# Altium schematic sheet LPCB225 - DISCHARGE.SchDoc
size A3; Address1: Factory 10; Address2: 9-13 Dingley Avenue, Dandeong, VICTORIA 3175, AUSTRALIA; DocumentNumber: 4; Revision: 1; SheetNumber: 4; SheetTotal: 6; Lockie__PCB_SUB_ASSEMBLY: Discharge Section; Lockie__PCB_ASSEMBLY: Module; Lockie__LDL: LPCB225; Lockie__PCB_DESCRIPTION: BMS Module
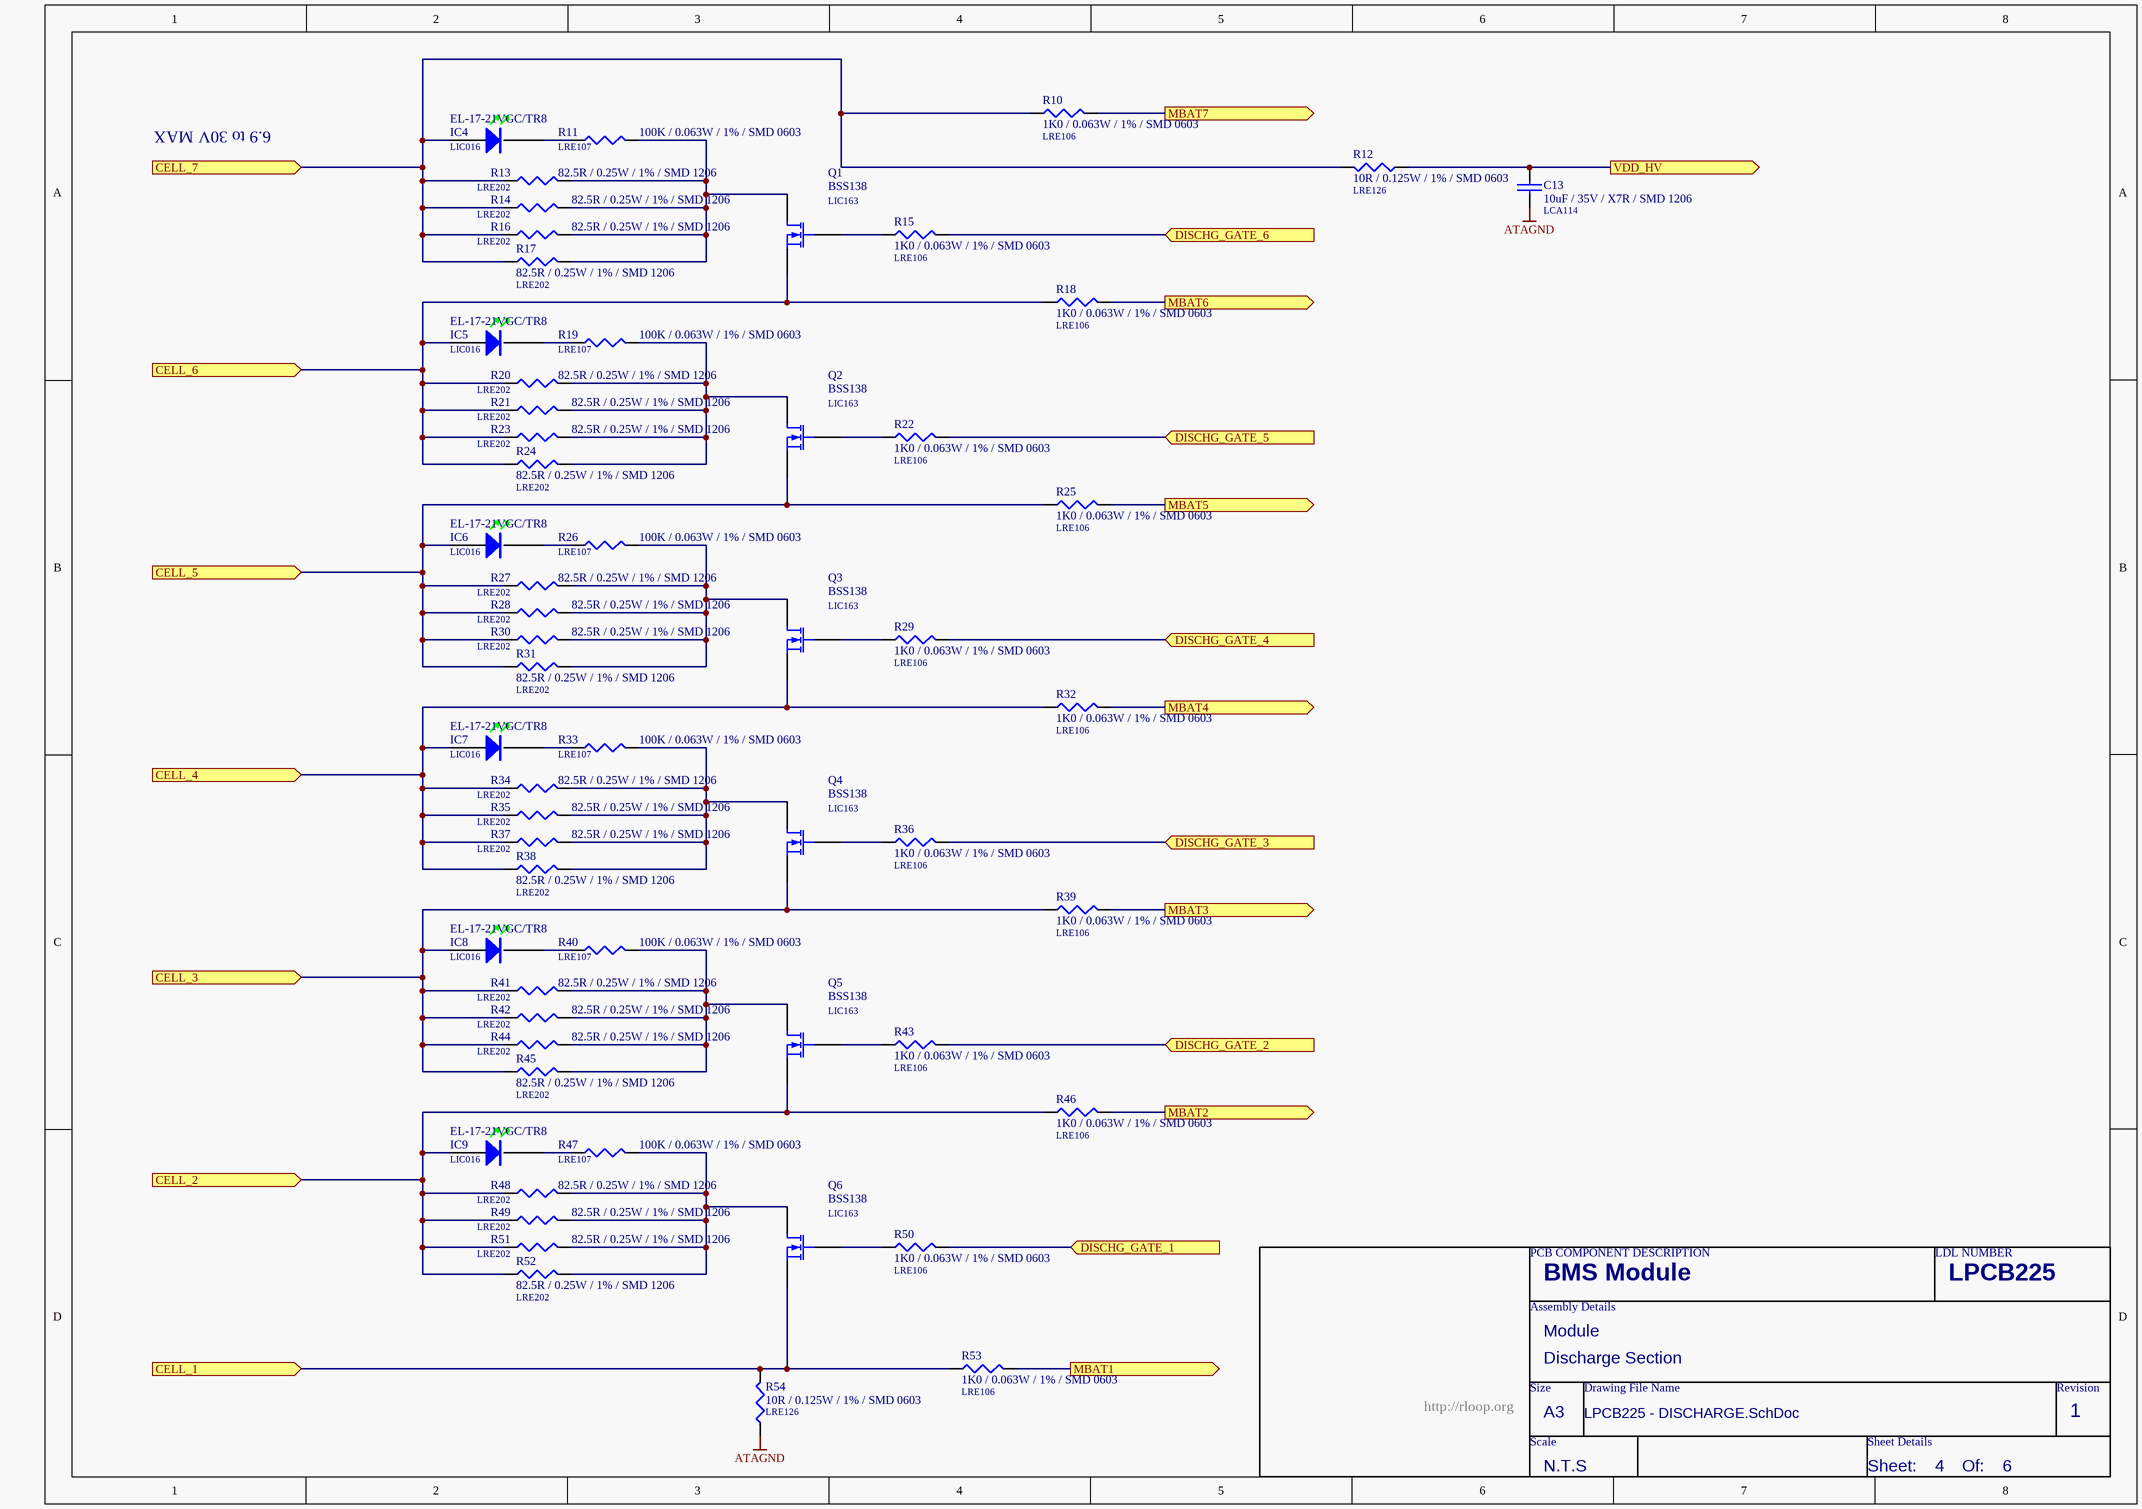
[diagram p0: LPCB225 - DISCHARGE.SchDoc]

## Parts
C13  10uF / 35V / X7R / SMD 1206  LDL_NUMBER: LCA114  [LFP043__CC3216-1206]
IC4  EL-17-21VGC/TR8  LDL_NUMBER: LIC016  [CR2012-0805-LED]
IC5  EL-17-21VGC/TR8  LDL_NUMBER: LIC016  [CR2012-0805-LED]
IC6  EL-17-21VGC/TR8  LDL_NUMBER: LIC016  [CR2012-0805-LED]
IC7  EL-17-21VGC/TR8  LDL_NUMBER: LIC016  [CR2012-0805-LED]
IC8  EL-17-21VGC/TR8  LDL_NUMBER: LIC016  [CR2012-0805-LED]
IC9  EL-17-21VGC/TR8  LDL_NUMBER: LIC016  [CR2012-0805-LED]
Q1  BSS138  LDL_NUMBER: LIC163  [LFP021__SOT23]
Q2  BSS138  LDL_NUMBER: LIC163  [LFP021__SOT23]
Q3  BSS138  LDL_NUMBER: LIC163  [LFP021__SOT23]
Q4  BSS138  LDL_NUMBER: LIC163  [LFP021__SOT23]
Q5  BSS138  LDL_NUMBER: LIC163  [LFP021__SOT23]
Q6  BSS138  LDL_NUMBER: LIC163  [LFP021__SOT23]
R10  1K0 / 0.063W / 1% / SMD 0603  LDL_NUMBER: LRE106  [LFP020__CR1608-0603-IPC7351_B]
R11  100K / 0.063W / 1% / SMD 0603  LDL_NUMBER: LRE107  [LFP020__CR1608-0603-IPC7351_B]
R12  10R / 0.125W / 1% / SMD 0603  LDL_NUMBER: LRE126  [LFP020__CR1608-0603-IPC7351_B]
R13  82.5R / 0.25W / 1% / SMD 1206  LDL_NUMBER: LRE202  [LFP107__CR3216-1206]
R14  82.5R / 0.25W / 1% / SMD 1206  LDL_NUMBER: LRE202  [LFP107__CR3216-1206]
R15  1K0 / 0.063W / 1% / SMD 0603  LDL_NUMBER: LRE106  [LFP020__CR1608-0603-IPC7351_B]
R16  82.5R / 0.25W / 1% / SMD 1206  LDL_NUMBER: LRE202  [LFP107__CR3216-1206]
R17  82.5R / 0.25W / 1% / SMD 1206  LDL_NUMBER: LRE202  [LFP107__CR3216-1206]
R18  1K0 / 0.063W / 1% / SMD 0603  LDL_NUMBER: LRE106  [LFP020__CR1608-0603-IPC7351_B]
R19  100K / 0.063W / 1% / SMD 0603  LDL_NUMBER: LRE107  [LFP020__CR1608-0603-IPC7351_B]
R20  82.5R / 0.25W / 1% / SMD 1206  LDL_NUMBER: LRE202  [LFP107__CR3216-1206]
R21  82.5R / 0.25W / 1% / SMD 1206  LDL_NUMBER: LRE202  [LFP107__CR3216-1206]
R22  1K0 / 0.063W / 1% / SMD 0603  LDL_NUMBER: LRE106  [LFP020__CR1608-0603-IPC7351_B]
R23  82.5R / 0.25W / 1% / SMD 1206  LDL_NUMBER: LRE202  [LFP107__CR3216-1206]
R24  82.5R / 0.25W / 1% / SMD 1206  LDL_NUMBER: LRE202  [LFP107__CR3216-1206]
R25  1K0 / 0.063W / 1% / SMD 0603  LDL_NUMBER: LRE106  [LFP020__CR1608-0603-IPC7351_B]
R26  100K / 0.063W / 1% / SMD 0603  LDL_NUMBER: LRE107  [LFP020__CR1608-0603-IPC7351_B]
R27  82.5R / 0.25W / 1% / SMD 1206  LDL_NUMBER: LRE202  [LFP107__CR3216-1206]
R28  82.5R / 0.25W / 1% / SMD 1206  LDL_NUMBER: LRE202  [LFP107__CR3216-1206]
R29  1K0 / 0.063W / 1% / SMD 0603  LDL_NUMBER: LRE106  [LFP020__CR1608-0603-IPC7351_B]
R30  82.5R / 0.25W / 1% / SMD 1206  LDL_NUMBER: LRE202  [LFP107__CR3216-1206]
R31  82.5R / 0.25W / 1% / SMD 1206  LDL_NUMBER: LRE202  [LFP107__CR3216-1206]
R32  1K0 / 0.063W / 1% / SMD 0603  LDL_NUMBER: LRE106  [LFP020__CR1608-0603-IPC7351_B]
R33  100K / 0.063W / 1% / SMD 0603  LDL_NUMBER: LRE107  [LFP020__CR1608-0603-IPC7351_B]
R34  82.5R / 0.25W / 1% / SMD 1206  LDL_NUMBER: LRE202  [LFP107__CR3216-1206]
R35  82.5R / 0.25W / 1% / SMD 1206  LDL_NUMBER: LRE202  [LFP107__CR3216-1206]
R36  1K0 / 0.063W / 1% / SMD 0603  LDL_NUMBER: LRE106  [LFP020__CR1608-0603-IPC7351_B]
R37  82.5R / 0.25W / 1% / SMD 1206  LDL_NUMBER: LRE202  [LFP107__CR3216-1206]
R38  82.5R / 0.25W / 1% / SMD 1206  LDL_NUMBER: LRE202  [LFP107__CR3216-1206]
R39  1K0 / 0.063W / 1% / SMD 0603  LDL_NUMBER: LRE106  [LFP020__CR1608-0603-IPC7351_B]
R40  100K / 0.063W / 1% / SMD 0603  LDL_NUMBER: LRE107  [LFP020__CR1608-0603-IPC7351_B]
R41  82.5R / 0.25W / 1% / SMD 1206  LDL_NUMBER: LRE202  [LFP107__CR3216-1206]
R42  82.5R / 0.25W / 1% / SMD 1206  LDL_NUMBER: LRE202  [LFP107__CR3216-1206]
R43  1K0 / 0.063W / 1% / SMD 0603  LDL_NUMBER: LRE106  [LFP020__CR1608-0603-IPC7351_B]
R44  82.5R / 0.25W / 1% / SMD 1206  LDL_NUMBER: LRE202  [LFP107__CR3216-1206]
R45  82.5R / 0.25W / 1% / SMD 1206  LDL_NUMBER: LRE202  [LFP107__CR3216-1206]
R46  1K0 / 0.063W / 1% / SMD 0603  LDL_NUMBER: LRE106  [LFP020__CR1608-0603-IPC7351_B]
R47  100K / 0.063W / 1% / SMD 0603  LDL_NUMBER: LRE107  [LFP020__CR1608-0603-IPC7351_B]
R48  82.5R / 0.25W / 1% / SMD 1206  LDL_NUMBER: LRE202  [LFP107__CR3216-1206]
R49  82.5R / 0.25W / 1% / SMD 1206  LDL_NUMBER: LRE202  [LFP107__CR3216-1206]
R50  1K0 / 0.063W / 1% / SMD 0603  LDL_NUMBER: LRE106  [LFP020__CR1608-0603-IPC7351_B]
R51  82.5R / 0.25W / 1% / SMD 1206  LDL_NUMBER: LRE202  [LFP107__CR3216-1206]
R52  82.5R / 0.25W / 1% / SMD 1206  LDL_NUMBER: LRE202  [LFP107__CR3216-1206]
R53  1K0 / 0.063W / 1% / SMD 0603  LDL_NUMBER: LRE106  [LFP020__CR1608-0603-IPC7351_B]
R54  10R / 0.125W / 1% / SMD 0603  LDL_NUMBER: LRE126  [LFP020__CR1608-0603-IPC7351_B]

## Ports
CELL_1 (in), CELL_2 (in), CELL_3 (in), CELL_4 (in), CELL_5 (in), CELL_6 (in), CELL_7 (in), DISCHG_GATE_1 (in), DISCHG_GATE_2 (in), DISCHG_GATE_3 (in), DISCHG_GATE_4 (in), DISCHG_GATE_5 (in), DISCHG_GATE_6 (in), MBAT1 (out), MBAT2 (out), MBAT3 (out), MBAT4 (out), MBAT5 (out), MBAT6 (out), MBAT7 (out), VDD_HV (out)

## Nets
ATAGND: C13.2 R54.1
CELL_1: Q6.2(S) R53.1 R54.2 ; port CELL_1
CELL_2: IC9.A Q5.2(S) R46.1 R48.1 R49.1 R51.1 R52.1 ; port CELL_2
CELL_3: IC8.A Q4.2(S) R39.1 R41.1 R42.1 R44.1 R45.1 ; port CELL_3
CELL_4: IC7.A Q3.2(S) R32.1 R34.1 R35.1 R37.1 R38.1 ; port CELL_4
CELL_5: IC6.A Q2.2(S) R25.1 R27.1 R28.1 R30.1 R31.1 ; port CELL_5
CELL_6: IC5.A Q1.2(S) R18.1 R20.1 R21.1 R23.1 R24.1 ; port CELL_6
CELL_7: IC4.A R10.1 R12.2 R13.1 R14.1 R16.1 R17.1 ; port CELL_7
DISCHG_GATE_1: R50.2 ; port DISCHG_GATE_1
DISCHG_GATE_2: R43.2 ; port DISCHG_GATE_2
DISCHG_GATE_3: R36.2 ; port DISCHG_GATE_3
DISCHG_GATE_4: R29.2 ; port DISCHG_GATE_4
DISCHG_GATE_5: R22.2 ; port DISCHG_GATE_5
DISCHG_GATE_6: R15.2 ; port DISCHG_GATE_6
MBAT1: R53.2 ; port MBAT1
MBAT2: R46.2 ; port MBAT2
MBAT3: R39.2 ; port MBAT3
MBAT4: R32.2 ; port MBAT4
MBAT5: R25.2 ; port MBAT5
MBAT6: R18.2 ; port MBAT6
MBAT7: R10.2 ; port MBAT7
VDD_HV: C13.1 R12.1 ; port VDD_HV
NetIC4_K: IC4.K R11.1
NetIC5_K: IC5.K R19.1
NetIC6_K: IC6.K R26.1
NetIC7_K: IC7.K R33.1
NetIC8_K: IC8.K R40.1
NetIC9_K: IC9.K R47.1
NetQ1_1: Q1.1(G) R15.1
NetQ1_3: Q1.3(D) R11.2 R13.2 R14.2 R16.2 R17.2
NetQ2_1: Q2.1(G) R22.1
NetQ2_3: Q2.3(D) R19.2 R20.2 R21.2 R23.2 R24.2
NetQ3_1: Q3.1(G) R29.1
NetQ3_3: Q3.3(D) R26.2 R27.2 R28.2 R30.2 R31.2
NetQ4_1: Q4.1(G) R36.1
NetQ4_3: Q4.3(D) R33.2 R34.2 R35.2 R37.2 R38.2
NetQ5_1: Q5.1(G) R43.1
NetQ5_3: Q5.3(D) R40.2 R41.2 R42.2 R44.2 R45.2
NetQ6_1: Q6.1(G) R50.1
NetQ6_3: Q6.3(D) R47.2 R48.2 R49.2 R51.2 R52.2

## Notes on the sheet
- 6.9 to 30V MAX
- PCB COMPONENT DESCRIPTION
- LDL NUMBER
- Assembly Details
- Size
- Drawing File Name
- Revision
- http://rloop.org
- Scale
- A3
- Sheet Details
- N.T.S
- Sheet:
- Of:

## Library data of the parts
C13 = 10uF / 35V / X7R / SMD 1206: Capactor, Ceramic Chip, 10uF, 35V, 20% (X7R), SMD 1206 [LCA114]; Value: 10u; FMEDA__OPERATING__TEMP_MAX: 50; FMEDA__OPERATING__TEMP_TYP: 27; FMEDA__OPERATING__TEMP_MIN: -20; FMEDA__OPERATING__VOLTAGE_MAX: 3.3; FMEDA__OPERATING__VOLTAGE_MIN: 0; FMEDA__CHANNEL: COM; FMEDA__FUNCTION_IN_SYSTEM: *; FMEDA__OPERATING__VOLTAGE_TYP: 3.3
IC4-IC9 = EL-17-21VGC/TR8: LED, SMD, 0805 Green [LIC016]; FMEDA__OPERATING__TEMP_MAX: 50; FMEDA__OPERATING__TEMP_MIN: -20; FMEDA__OPERATING__TEMP_TYP: 27; FMEDA__CHANNEL: COM; FMEDA__FUNCTION_IN_SYSTEM: *
Q1-Q6 = BSS138: FET, N Channel, Logic Level, SMD SOT23 [LIC163]; FMEDA__OPERATING__TEMP_MAX: 50; FMEDA__OPERATING__TEMP_MIN: -20; FMEDA__OPERATING__TEMP_TYP: 27; FMEDA__CHANNEL: COM
R10 R15 R18 R22 R25 R29 R32 R36 R39 R43 R46 R50 R53 = 1K0 / 0.063W / 1% / SMD 0603: Resistor, Ceramic Chip, 1K0, 0.063W, 1%, SMD 0603 [LRE106]; Value: 1K; FMEDA__OPERATING__POWER_MAX: 0; FMEDA__OPERATING__TEMP_MAX: 50; FMEDA__OPERATING__TEMP_MIN: -20; FMEDA__OPERATING__TEMP_TYP: 27; FMEDA__CHANNEL: COM; FMEDA__OPERATING__POWER_MIN: 0; FMEDA__OPERATING__VOLTAGE_MAX: 0; FMEDA__OPERATING__VOLTAGE_MIN: 0; FMEDA__OPERATING__VOLTAGE_TYP: 0; FMEDA__FUNCTION_IN_SYSTEM: *
R11 R19 R26 R33 R40 R47 = 100K / 0.063W / 1% / SMD 0603: Resistor, Ceramic Chip, 100K0, 0.063W, 1%, SMD 0603 [LRE107]; FMEDA__OPERATING__POWER_MAX: 0; FMEDA__OPERATING__TEMP_MAX: 50; FMEDA__OPERATING__TEMP_MIN: -20; FMEDA__OPERATING__TEMP_TYP: 27; FMEDA__CHANNEL: COM; Value: 100K; FMEDA__OPERATING__POWER_MIN: 0; FMEDA__OPERATING__VOLTAGE_MAX: 0; FMEDA__OPERATING__VOLTAGE_MIN: 0; FMEDA__OPERATING__VOLTAGE_TYP: 0; FMEDA__FUNCTION_IN_SYSTEM: *
R12 R54 = 10R / 0.125W / 1% / SMD 0603: Resistor, Ceramic Chip, 10R, 0.063W, 1%, SMD 0603 [LRE126]; Value: 10; FMEDA__OPERATING__POWER_MAX: 0; FMEDA__OPERATING__TEMP_MAX: 50; FMEDA__OPERATING__TEMP_MIN: -20; FMEDA__OPERATING__TEMP_TYP: 27; FMEDA__CHANNEL: COM; FMEDA__FUNCTION_IN_SYSTEM: *; FMEDA__OPERATING__POWER_MIN: 0; FMEDA__OPERATING__VOLTAGE_MAX: 0; FMEDA__OPERATING__VOLTAGE_MIN: 0; FMEDA__OPERATING__VOLTAGE_TYP: 0
R13 R14 R16 R17 R20 R21 R23 R24 R27 R28 R30 R31 R34 R35 R37 R38 R41 R42 R44 R45 R48 R49 R51 R52 = 82.5R / 0.25W / 1% / SMD 1206: Resistor, Ceramic Chip, 82.5R, 0.25W, 1%, SMD 1206 [LRE202]; VALUE: 82.5; FMEDA__OPERATING__POWER_MAX: 0; FMEDA__OPERATING__TEMP_MAX: 50; FMEDA__OPERATING__TEMP_MIN: -20; FMEDA__OPERATING__TEMP_TYP: 27; FMEDA__CHANNEL: COM; FMEDA__OPERATING__POWER_MIN: 0; FMEDA__OPERATING__VOLTAGE_MAX: 0; FMEDA__OPERATING__VOLTAGE_MIN: 0; FMEDA__OPERATING__VOLTAGE_TYP: 0; FMEDA__FUNCTION_IN_SYSTEM: *